# Altium schematic sheet ClockGenerator.SchDoc
size 420 x 297 mm; DocumentNumber: ClockGenerator
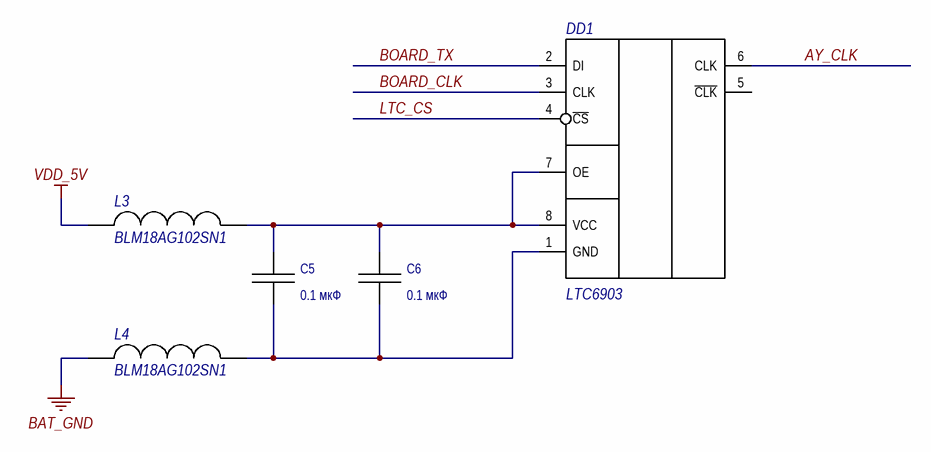
[diagram p0: ClockGenerator.SchDoc]

## Parts
C5  value 0.1 мкФ  [C 1206]  (hidden comment: 1 мкФ)
C6  value 0.1 мкФ  [C 1206]  (hidden comment: 2.2 мкФ)
DD1  LTC6903  [MSOP_MS8]
L3  BLM18AG102SN1  [FB 0603]
L4  BLM18AG102SN1  [FB 0603]

## Nets
BAT_GND: L4.1
VDD_5V: L3.1
AY_CLK: DD1.6(CLK)
BOARD_CLK: DD1.3(CLK)
BOARD_TX: DD1.2(DI)
LTC_CS: DD1.4(~{CS})
NetC5_1: C5.1 C6.1 DD1.7(OE) DD1.8(VCC) L3.2
NetC5_2: C5.2 C6.2 DD1.1(GND) L4.2

Not connected (* = marked no-connect by the designer): DD1 5(~{CLK})

## Notes on the sheet
- Подп. и дата
- Инв. № дубл.
- Взам. инв. №
- Инв. № подл.
- Лист
- Изм.
- № докум.
- Подп.
- Дата
- Копировал
- Формат А3

## Library data of the parts
C5 C6 = CAP 1206: SMD Capacitor 1206; Manufacturer: /Укажите компанию-производителя/; Tolerance: /Укажите допуск в процентах/; Temperature coefficient: /Формат: ±? ppm/°C/; Type: Конденсатор керамический; TC: /Укажите тип диэлектрика/; Size: 1206; Temperature range: /Формат: -? ... ? °C/